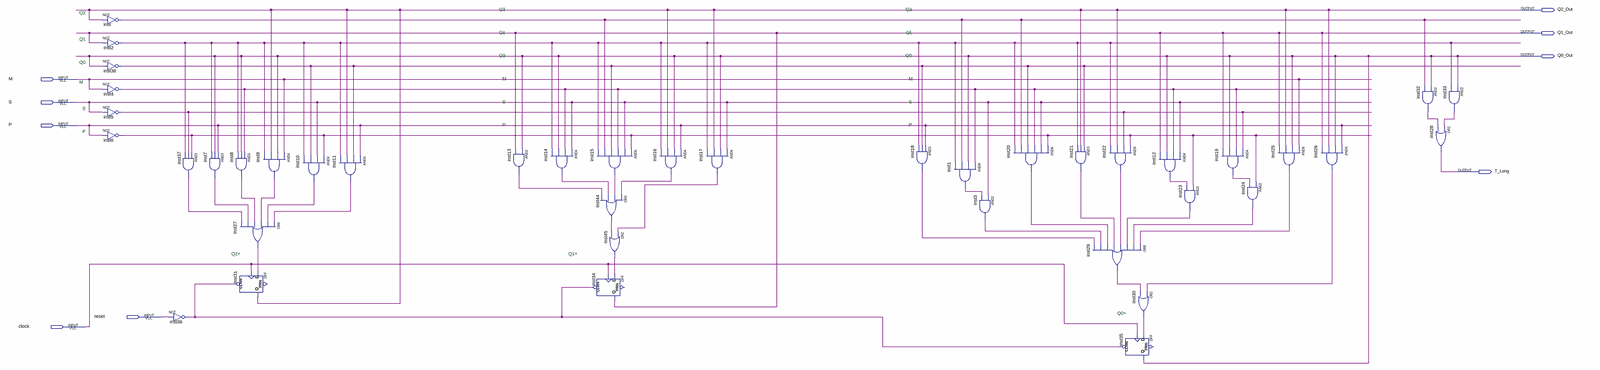
[diagram p0: schematic sheet, whole]
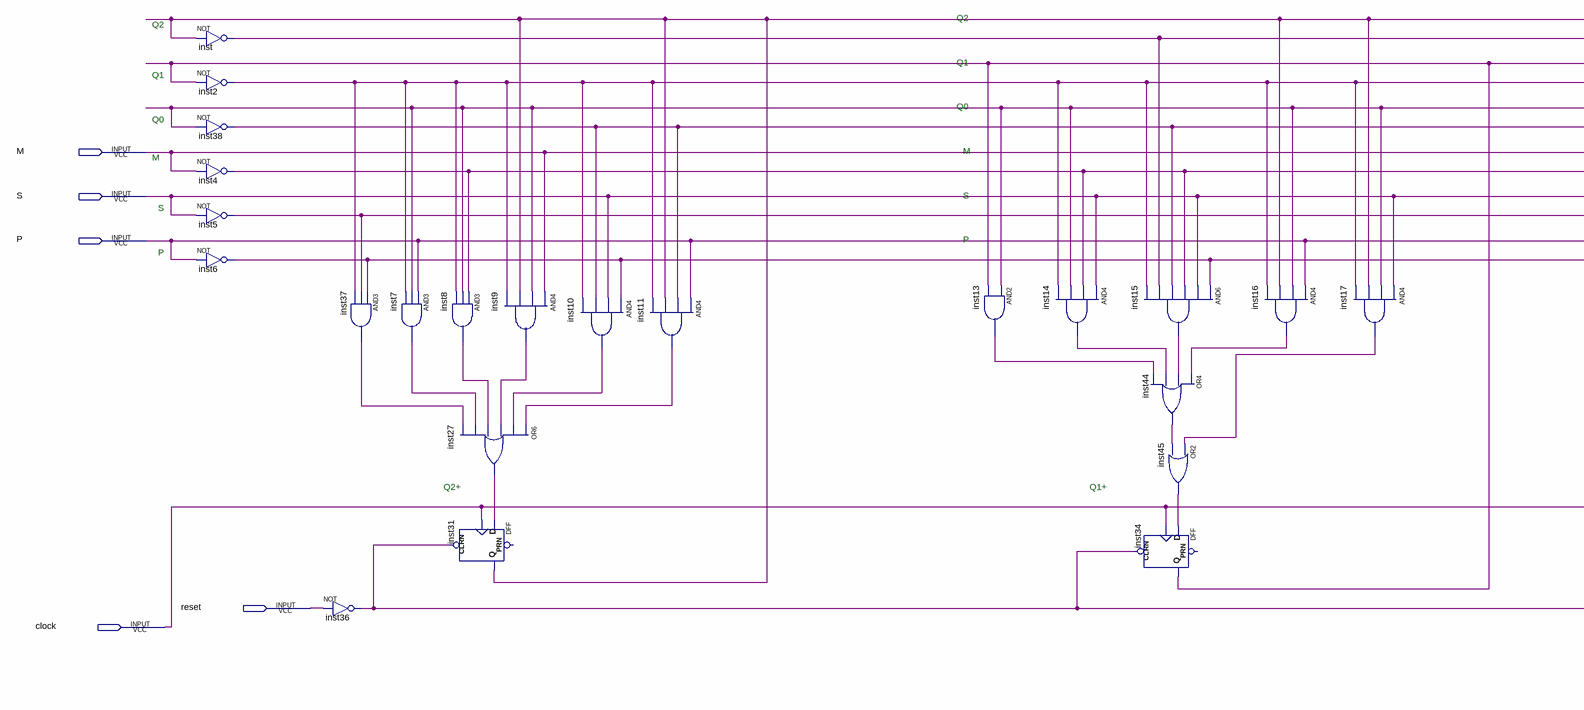
[diagram p1: schematic sheet, left part]
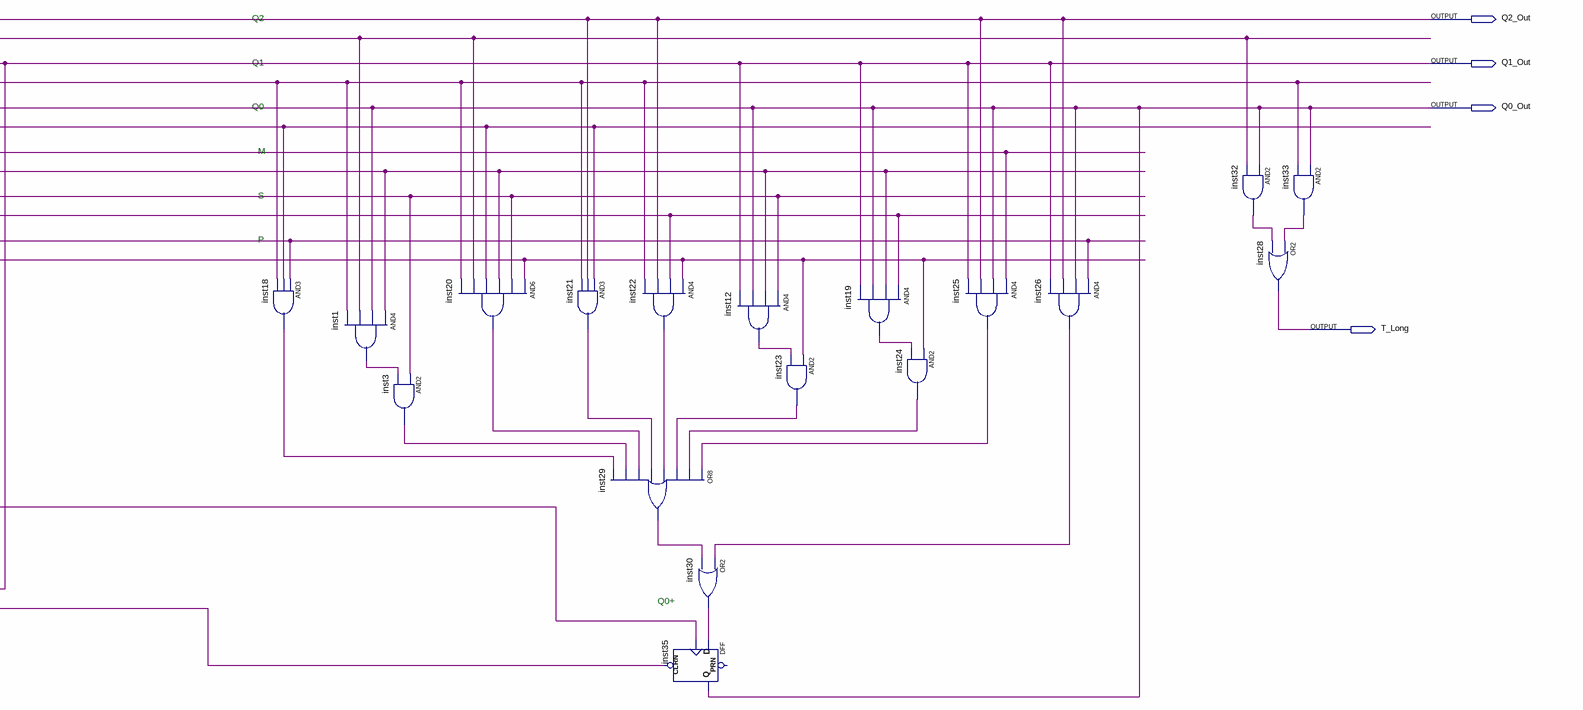
[diagram p2: schematic sheet, right part]
// Quartus schematic MooreMachine.bdf as structural Verilog: 41 symbols, 9 pins
module MooreMachine (
  input  M,
  input  S,
  input  P,
  input  reset,
  input  clock,
  output Q2_Out,
  output Q1_Out,
  output Q0_Out,
  output T_Long
);

  wire inst1_out, inst2_out, inst3_out, inst4_out, inst5_out, inst6_out, inst7_out, inst8_out, inst9_out,
       inst10_out, inst11_out, inst12_out, inst13_out, inst14_out, inst15_out, inst16_out, inst17_out,
       inst18_out, inst19_out, inst20_out, inst21_out, inst22_out, inst23_out, inst24_out, inst25_out,
       inst26_out, inst27_out, inst29_out, inst30_out, inst32_out, inst33_out, inst36_out, inst37_out,
       inst38_out, inst44_out, inst45_out, inst_out;

  not inst (inst_out, Q2_Out);
  not inst2 (inst2_out, Q1_Out);
  not inst38 (inst38_out, Q0_Out);
  not inst4 (inst4_out, M);
  not inst5 (inst5_out, S);
  not inst6 (inst6_out, P);
  and inst37 (inst37_out, inst6_out, inst5_out, inst2_out);
  not inst36 (inst36_out, reset);
  and inst7 (inst7_out, P, Q0_Out, inst2_out);
  and inst8 (inst8_out, inst4_out, Q0_Out, inst2_out);
  and inst9 (inst9_out, M, Q0_Out, Q2_Out, inst2_out);
  or inst27 (inst27_out, inst11_out, inst10_out, inst9_out, inst8_out, inst7_out, inst37_out);
  DFF inst31 (.CLRN(inst36_out), .CLK(clock), .D(inst27_out), .Q(Q2_Out));  // open: PRN
  and inst10 (inst10_out, inst6_out, S, inst38_out, inst2_out);
  and inst11 (inst11_out, P, inst38_out, Q2_Out, inst2_out);
  and inst13 (inst13_out, Q0_Out, Q1_Out);
  and inst14 (inst14_out, S, inst4_out, Q0_Out, inst2_out);
  and inst15 (inst15_out, inst6_out, S, inst4_out, inst38_out, inst_out, inst2_out);
  or inst44 (inst44_out, inst16_out, inst15_out, inst14_out, inst13_out);
  DFF inst34 (.CLRN(inst36_out), .CLK(clock), .D(inst45_out), .Q(Q1_Out));  // open: PRN
  or inst45 (inst45_out, inst17_out, inst44_out);
  and inst16 (inst16_out, P, Q0_Out, Q2_Out, inst2_out);
  and inst17 (inst17_out, S, Q0_Out, Q2_Out, inst2_out);
  and inst18 (inst18_out, P, inst38_out, inst2_out);
  and inst1 (inst1_out, inst4_out, Q0_Out, inst_out, inst2_out);
  and inst3 (inst3_out, S, inst1_out);
  and inst20 (inst20_out, inst6_out, S, inst4_out, inst38_out, inst_out, inst2_out);
  and inst21 (inst21_out, inst38_out, Q2_Out, inst2_out);
  and inst22 (inst22_out, inst6_out, inst5_out, Q2_Out, inst2_out);
  or inst29 (inst29_out, inst25_out, inst24_out, inst23_out, inst22_out, inst21_out, inst20_out, inst3_out, inst18_out);
  DFF inst35 (.CLRN(inst36_out), .CLK(clock), .D(inst30_out), .Q(Q0_Out));  // open: PRN
  and inst12 (inst12_out, S, inst4_out, Q0_Out, Q1_Out);
  or inst30 (inst30_out, inst26_out, inst29_out);
  and inst23 (inst23_out, inst6_out, inst12_out);
  and inst19 (inst19_out, inst5_out, inst4_out, Q0_Out, Q1_Out);
  and inst24 (inst24_out, inst6_out, inst19_out);
  and inst25 (inst25_out, M, Q0_Out, Q2_Out, Q1_Out);
  and inst26 (inst26_out, P, Q0_Out, Q2_Out, Q1_Out);
  and inst32 (inst32_out, Q0_Out, inst_out);
  and inst33 (inst33_out, Q0_Out, inst2_out);
  or inst28 (T_Long, inst33_out, inst32_out);

  // Notes on the sheet:
  //   Q2
  //   Q2
  //   Q2
  //   Q1
  //   Q1
  //   Q1
  //   Q0
  //   Q0
  //   Q0
  //   M
  //   M
  //   M
  //   S
  //   S
  //   S
  //   P
  //   P
  //   P
  //   Q2+
  //   Q1+
  //   Q0+
endmodule
